# EAGLE design Nozzle Magazine v2 (EAGLE 9.6.2)
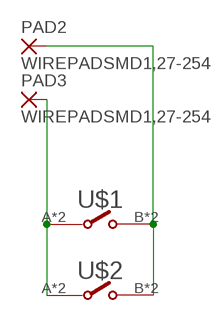
[diagram p0: schematic, sheet 1]

## Parts
PAD2  WIREPADSMD1,27-254  [SMD1,27-2,54]
PAD3  WIREPADSMD1,27-254  [SMD1,27-2,54]
U$1  SWITCH_LIMIT_HDP001L  [SWITCH_LIMIT_HDP001L]
U$2  SWITCH_LIMIT_HDP001L  [SWITCH_LIMIT_HDP001L]

## Nets
N$1: PAD3.1(P) U$1.A U$1.C U$2.A U$2.C
N$2: PAD2.1(P) U$1.B U$1.D U$2.B U$2.D

## Library data of the parts
PAD2 PAD3 = wirepad:WIREPAD: Wire PAD connect wire on PCB
U$1 U$2 = Shai-Parts:SWITCH_LIMIT_HDP001L

## Board
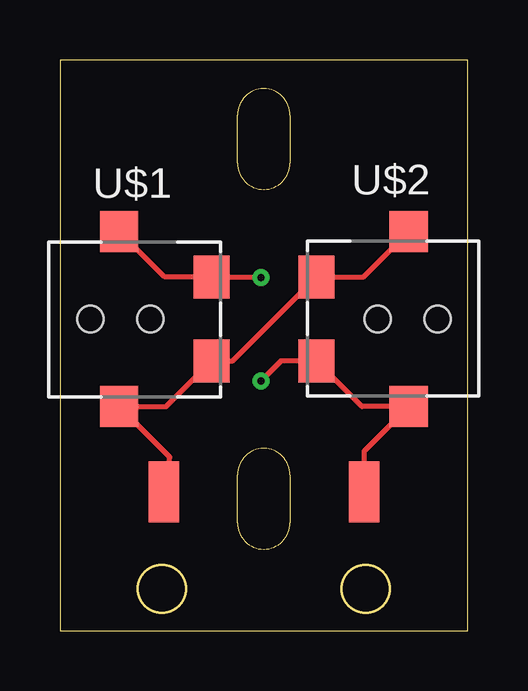
[diagram p1: board, top side]
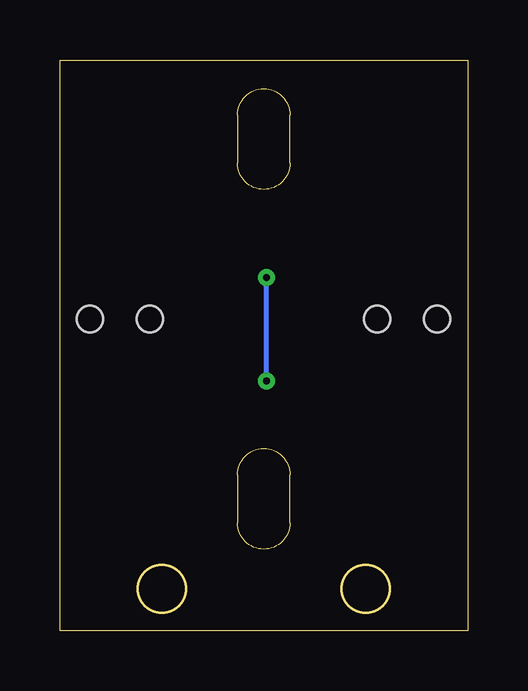
[diagram p2: board, bottom side, seen from below]

Size 17 x 23.8 mm. Coordinates in mm from the lower left corner, seen from the top.
Outline: 7.4,4.5 arc180 9.6,4.5 9.6,6.5 arc180 7.4,6.5 7.4,4.5
Outline: 9.6,21.5 9.6,19.5 arc-180 7.4,19.5 7.4,21.5 arc-180 9.6,21.5
Outline: 0,23.8 0,0 17,0 17,23.8 0,23.8
Outline: circle at 4.25,1.75 radius 1
Outline: circle at 12.75,1.75 radius 1
Copper layers (1*16): Top 0.035mm / dielectric 1.5mm / Bottom 0.035mm
Design rules "default *": minimum track width 6mil, minimum drill 0.3mm, track to track 6mil, track to pad 6mil, pad to pad 6mil, via to via 6mil, smd to smd 6mil, copper to edge 40mil, drill to drill 6mil, minimum pad ring 10mil, minimum via ring 8mil, stop-mask expansion 4mil, vias tented up to drill 0.3mm, thermal gap 10mil
Holes 1.1 mm at 1.27,13 3.77,13 15.75,13 13.25,13 1.27,13 3.77,13 15.75,13 13.25,13 1.27,13 3.77,13 15.75,13 13.25,13 1.27,13 3.77,13 15.75,13 13.25,13 1.27,13 3.77,13 15.75,13 13.25,13 1.27,13 3.77,13 15.75,13 13.25,13 1.27,13 3.77,13 15.75,13 13.25,13 1.27,13 3.77,13 15.75,13 13.25,13 1.27,13 3.77,13 15.75,13 13.25,13 1.27,13 3.77,13 15.75,13 13.25,13 1.27,13 3.77,13 15.75,13 13.25,13 1.27,13 3.77,13 15.75,13 13.25,13 1.27,13 3.77,13 15.75,13 13.25,13 1.27,13 3.77,13 15.75,13 13.25,13 1.27,13 3.77,13 15.75,13 13.25,13 1.27,13 3.77,13 15.75,13 13.25,13

### Footprints (pad centres in the part's own frame; a part is rotated, then mirrored left to right if it is on the bottom)
SMD1,27-2,54 = smd 1.27 x 2.54: 1 0,0
SWITCH_LIMIT_HDP001L = smd 1.8 x 1.5: A -1.75,-5.05; B 1.75,-5.05 | smd 1.7 x 1.6: C -3.65,-1.2; D 3.65,-1.2 | hole 1.1: 0,0; 0,-2.5

### Placement (x,y rotation side)
PAD2  12.69,5.79 0 top
PAD3  4.33,5.79 0 top
U$1  1.27,13 90 top
U$2  15.75,13 270 top

### Tracks (layer width: path | path; a pad name or v marks a point on that pad's centre or on a via)
N$1
  Top 0.203: PAD3.1 4.58,7.24 U$1.C 4.42,9.35 U$1.A 7.2,11.25 U$2.A 12.65,14.75 U$2.C
N$2  (via drill 0.3)
  Top 0.203: PAD2.1 12.69,7.49 U$2.D 12.6,9.35 U$2.B 9.22,11.25 v8.38,10.41 | v8.38,14.73 6.34,14.73 U$1.B 4.37,14.75 U$1.D
  Bottom 0.203: v8.38,10.41 v8.38,14.73